# EasyEDA Pro project DCDC_Buck_Codex_Optimized_v3_livefit_20260618.epro

# Board PCB1
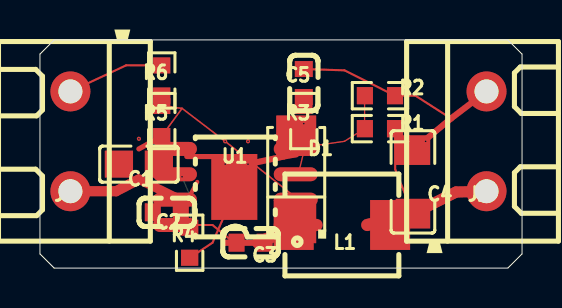
[diagram p0: board, top side]
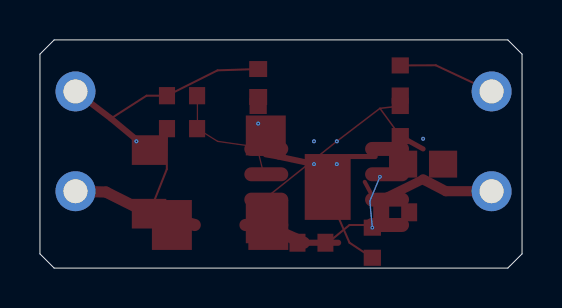
[diagram p1: board, bottom side, seen from below]

Outline 24.13 x 11.43 mm; copper layers: Top Layer, Bottom Layer. Coordinates in mm from the lower left corner of the outline.
Outline path: 0,10.72 0,0.71 0.71,0 23.42,0 24.13,0.71 24.13,10.72 23.42,11.43 0.71,11.43 0,10.72
Stack: Top Layer 0.035mm / Dielectric1 1.51mm FR4 er 4.5 / Bottom Layer 0.035mm

## Design rules (mm)
spacing copperThickness1oz (default): track to track 0.102, other pairs 0.152 to 0.3
spacing copperThickness2oz: track to track 0.203, other pairs 0.152 to 0.3
track width copperThickness1oz (default): min 0.127, default 0.254, max 2.54
track width copperThickness2oz: min 0.203, default 0.254, max 2.54
differential pair differentialPair (default): width min 0.127, default 0.254, max 2.54; gap min 0.152, default 0.152

## Placement (name value [footprint] x y rotation side)
C1  -  [C0805]  4.95 5.21 180 top
C2  100nF  [C0603]  6.35 2.79 180 top
C3  -  [C0603]  10.54 1.27 180 top
C4  -  [C1206]  18.67 4.32 270 top
C5  -  [C0603]  13.21 9.27 90 top
D1  SS34  [SMA_L4.3-W2.6-LS5.2-RD]  12.83 4.45 90 top
J1  KF301-2P接线端子  [CONN-TH_XY301V-A-5.0-2P]  1.52 6.35 90 top
J2  KF301-2P接线端子  [CONN-TH_XY301V-A-5.0-2P]  22.35 6.35 270 top
L1  10uH/3A  [IND-SMD_L5.7-W5.1]  15.11 2.16 0 top
R1  -  [R0603]  17.02 6.98 0 top
R2  -  [R0603]  17.02 8.64 180 top
R3  -  [R0603]  13.21 7.37 90 top
R4  -  [R0603]  7.49 1.27 90 top
R5  -  [R0603]  6.1 7.37 90 top
R6  -  [R0603]  6.1 9.4 90 top
U1  MP1584EN  [SOIC-8_L4.9-W3.9-P1.27-LS6.0-BL-EP3.3]  9.78 4.06 90 top

## Footprints (pads in the part's own frame, mm; a bottom-side part is the same pattern mirrored in y, then rotated)
C0603
  rect 0.8x0.9 smd: 1(-0.7,0) 2(0.7,0)
C0805
  rect 1.41x1.35 smd: 1(-1,0) 2(1,0)
C1206
  rect 1.485x1.728 smd: 1(-1.593,0) 2(1.593,0)
CONN-TH_XY301V-A-5.0-2P
  round 2 hole 1.2: 1(-2.5,0) 2(2.5,0)
IND-SMD_L5.7-W5.1
  rect 2x2.5 smd: 1(-2.413,0) 2(2.413,0)
R0603
  rect 0.806x0.864 smd: 1(-0.753,0) 2(0.753,0)
SMA_L4.3-W2.6-LS5.2-RD
  rect 2x2 smd: 1(-2.2,0) 2(2.2,0)
SOIC-8_L4.9-W3.9-P1.27-LS6.0-BL-EP3.3
  oval 0.7x2.2 smd: 1(-1.905,-3.022) 2(-0.635,-3.022) 3(0.635,-3.022) 4(1.905,-3.022) 5(1.905,3.022) 6(0.635,3.022) 7(-0.635,3.022) 8(-1.905,3.022)
  rect 3.3x2.3 smd: 9(0,0.051)

## Nets
GND: C1.1 C2.1 C4.1 C5.1 D1.2 J1.2 J2.1 R2.1 R4.1 R6.1 U1.5 U1.9
VIN: C1.2 C2.2 J1.1 R5.1 U1.7
BST: C3.1 U1.8
COMP: R3.1 U1.3
COMP_RC: C5.2 R3.2
EN: R5.2 R6.2 U1.2
FB: R1.1 R2.2 U1.4
FREQ: R4.2 U1.6
SW: C3.2 D1.1 L1.1 U1.1
VOUT: C4.2 J2.2 L1.2 R1.2

## Via types
v1: diameter 0.203, hole 0.089, Top Layer to Bottom Layer, 7 vias
v2: diameter 0.191, hole 0.089, Top Layer to Bottom Layer, 2 vias

## Routing (per net, layer and track width the routed paths; a pad name or vN(x,y) marks a point on that pad's centre or on a via; arc(x,y) is an arc through that point)
GND: length 28.8
  Top Layer w0.102: 9.85,4.06 8.64,1.27 R4.1 ; 6.1,10.15 4.32,10.16 J1.2 ; 13.21,9.97 15.24,9.91 R2.1 18.8,8.64 20.57,7.49
  Top Layer w0.203: C2.1 7.87,4.32
  Top Layer w0.254: 7.35,5.59 8.64,5.59
  Top Layer w0.305: C4.1 20.57,7.49 J2.1 ; 12.83,5.7 12.19,5.59 v1(10.41,5.21) 9.85,4.06
  vias: v1(4.95,6.48) v1(9.27,6.35) v1(9.27,5.21) v1(10.41,6.35) v1(13.21,7.24) v1(19.3,6.35)
VIN: length 7.1
  Top Layer w0.254: 4.95,5.97 6.1,6.6
  Top Layer w0.457: 6.88,3.43 6.76,3.56 4.95,4.45
  Top Layer w0.508: 4.95,4.45 3.81,3.85 J1.1
BST: length 3.1
  Top Layer w0.102: 9.71,1.27 8.64,2.16 6.88,2.16
COMP: length 2
  Top Layer w0.064: R3.1 13.34,6.35 12.93,4.7
COMP_RC: length 0.4
  Top Layer w0.064: R3.2 13.21,8.57
EN: length 10.1
  Top Layer w0.076: 12.93,3.43 9.27,6.35 7.11,8 ; R5.2 7.11,8 ; 7.11,8 6.1,6.61
FB: length 5.2
  Top Layer w0.064: 16.25,8.64 16.25,6.98 15.24,6.35 13.46,6.1 12.93,5.97
FREQ: length 2.9
  Top Layer w0.064: 6.88,4.7 v2(7.11,4.57)
  Bottom Layer w0.064: v2(7.11,4.57) 7.62,3.35 v2(7.49,2.02)
SW: length 5.8
  Top Layer w0.305: 9.21,1.27 10.92,1.27
  Top Layer w0.61: 12.95,2.16 13.84,2.16 ; 12.95,2.16 10.92,1.27 ; 12.95,2.16 12.83,3.18
VOUT: length 10.7
  Top Layer w0.102: R1.2 17.78,4.95 C4.2
  Top Layer w0.559: J2.2 20.83,3.81 C4.2
  Top Layer w0.61: 16.38,2.16 C4.2

## Copper pours and planes (outline as drawn; the poured copper is in the pictures)
GND on Top Layer: 4.06,19.36 4.08,19.48 4.13,19.65 4.22,19.79 4.34,19.91 4.48,20 4.65,20.05 4.78,20.07 21.13,20.07 21.26,20.05 21.42,20 21.57,19.91 21.69,19.79 21.78,19.65 21.83,19.48 21.84,19.36 21.84,18.49 21.83,18.36 21.78,18.2 21.69,18.05 21.57,17.93 21.42,17.84 21.26,17.79 21.13,17.78 4.78,17.78 4.65,17.79 4.48,17.84 4.34,17.93 4.22,18.05 4.13,18.2 4.08,18.36 4.06,18.49
GND on Bottom Layer: 4.06,19.36 4.08,19.48 4.13,19.65 4.22,19.79 4.34,19.91 4.48,20 4.65,20.05 4.78,20.07 21.13,20.07 21.26,20.05 21.42,20 21.57,19.91 21.69,19.79 21.78,19.65 21.83,19.48 21.84,19.36 21.84,18.49 21.83,18.36 21.78,18.2 21.69,18.05 21.57,17.93 21.42,17.84 21.26,17.79 21.13,17.78 4.78,17.78 4.65,17.79 4.48,17.84 4.34,17.93 4.22,18.05 4.13,18.2 4.08,18.36 4.06,18.49
